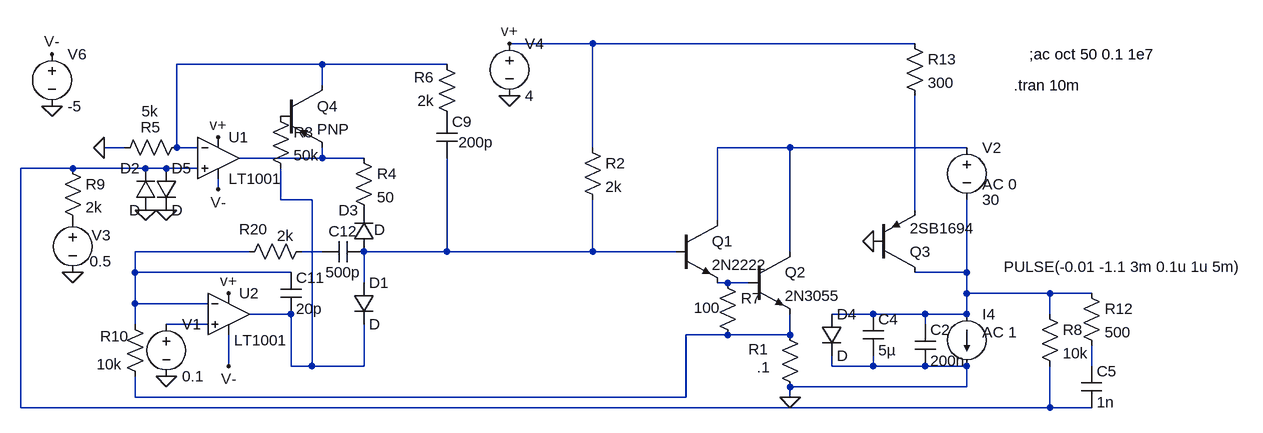
[diagram p0: schematic LDO Regler2 - simple_AW.asc]
LDO Regler2 - simple_AW.asc, the LTspice schematic file:
Version 4
SHEET 1 20904 1220
WIRE 5696 -5488 5568 -5488
WIRE 6192 -5488 5696 -5488
WIRE 5280 -5456 5056 -5456
WIRE 5472 -5456 5280 -5456
WIRE 5280 -5424 5280 -5456
WIRE 4976 -5328 4944 -5328
WIRE 5056 -5328 5056 -5456
WIRE 5088 -5328 5056 -5328
WIRE 5696 -5328 5696 -5488
WIRE 6000 -5328 5888 -5328
WIRE 6272 -5328 6000 -5328
WIRE 5280 -5312 5280 -5328
WIRE 5280 -5312 5152 -5312
WIRE 5344 -5312 5280 -5312
WIRE 4896 -5296 4816 -5296
WIRE 5008 -5296 4896 -5296
WIRE 5040 -5296 5008 -5296
WIRE 5088 -5296 5040 -5296
WIRE 5120 -5264 5120 -5280
WIRE 5216 -5248 5216 -5296
WIRE 5264 -5248 5216 -5248
WIRE 6192 -5232 6192 -5408
WIRE 5888 -5216 5888 -5328
WIRE 5168 -5168 4992 -5168
WIRE 5280 -5168 5248 -5168
WIRE 5472 -5168 5472 -5312
WIRE 5472 -5168 5344 -5168
WIRE 5696 -5168 5696 -5248
WIRE 5696 -5168 5472 -5168
WIRE 5824 -5168 5696 -5168
WIRE 6000 -5168 6000 -5328
WIRE 4992 -5136 4992 -5168
WIRE 5232 -5136 4992 -5136
WIRE 6272 -5136 6272 -5248
WIRE 6272 -5136 6192 -5136
WIRE 5344 -5120 5344 -5168
WIRE 5904 -5120 5888 -5120
WIRE 5936 -5120 5904 -5120
WIRE 6272 -5104 6272 -5136
WIRE 6400 -5104 6272 -5104
WIRE 6464 -5104 6400 -5104
WIRE 4992 -5088 4992 -5136
WIRE 5104 -5088 4992 -5088
WIRE 5232 -5072 5168 -5072
WIRE 6128 -5072 6064 -5072
WIRE 6208 -5072 6128 -5072
WIRE 6272 -5072 6272 -5104
WIRE 6272 -5072 6208 -5072
WIRE 6400 -5072 6400 -5104
WIRE 4992 -5056 4992 -5088
WIRE 5104 -5056 5040 -5056
WIRE 6208 -5056 6208 -5072
WIRE 5904 -5040 5840 -5040
WIRE 6000 -5040 6000 -5072
WIRE 6000 -5040 5904 -5040
WIRE 5136 -4992 5136 -5040
WIRE 5232 -4992 5232 -5072
WIRE 5264 -4992 5264 -5248
WIRE 5264 -4992 5232 -4992
WIRE 5344 -4992 5344 -5056
WIRE 5344 -4992 5264 -4992
WIRE 6064 -4992 6064 -5008
WIRE 6128 -4992 6128 -5008
WIRE 6128 -4992 6064 -4992
WIRE 6208 -4992 6128 -4992
WIRE 6272 -4992 6208 -4992
WIRE 6464 -4992 6464 -5024
WIRE 6272 -4960 6272 -4992
WIRE 6272 -4960 6000 -4960
WIRE 4992 -4944 4992 -4976
WIRE 5840 -4944 5840 -5040
WIRE 5840 -4944 4992 -4944
WIRE 6000 -4944 6000 -4960
WIRE 4816 -4928 4816 -5296
WIRE 6400 -4928 6400 -4992
WIRE 6400 -4928 4816 -4928
WIRE 6464 -4928 6400 -4928
FLAG 6000 -4944 0
FLAG 4896 -5136 0
FLAG 5040 -5232 0
FLAG 4864 -5392 0
FLAG 4864 -5472 V-
FLAG 5120 -5264 V-
FLAG 4944 -5328 0
FLAG 5136 -4992 V-
FLAG 5568 -5488 v+
FLAG 5136 -5104 v+
FLAG 5120 -5344 v+
FLAG 5008 -5232 0
FLAG 5040 -4976 0
FLAG 6128 -5184 0
FLAG 5568 -5408 0
SYMBOL voltage 6272 -5344 R0
WINDOW 123 24 72 Left 2
WINDOW 39 24 44 Left 2
SYMATTR Value2 AC 0
SYMATTR InstName V2
SYMATTR Value 30
SYMBOL npn 5936 -5168 R0
SYMATTR InstName Q2
SYMATTR Value 2N3055
SYMBOL res 5984 -5056 R0
WINDOW 0 -17 38 Right 2
WINDOW 3 -15 66 Right 2
SYMATTR InstName R1
SYMATTR Value .1
SYMBOL npn 5824 -5216 R0
SYMATTR InstName Q1
SYMATTR Value 2N2222
SYMBOL voltage 5040 -5072 R0
WINDOW 123 24 72 Left 2
WINDOW 39 24 44 Left 2
SYMATTR InstName V1
SYMATTR Value 0.1
SYMBOL diode 5360 -5168 R180
WINDOW 0 24 64 Left 2
WINDOW 3 -17 34 Left 2
SYMATTR InstName D3
SYMBOL cap 6192 -5056 R0
SYMATTR InstName C2
SYMATTR Value 200n
SYMATTR SpiceLine Rser=10m
SYMBOL res 6384 -5088 R0
SYMATTR InstName R8
SYMATTR Value 10k
SYMBOL res 4880 -5312 R0
SYMATTR InstName R9
SYMATTR Value 2k
SYMBOL voltage 4896 -5232 R0
WINDOW 123 24 72 Left 2
WINDOW 39 24 44 Left 2
WINDOW 0 29 39 Left 2
WINDOW 3 26 79 Left 2
SYMATTR InstName V3
SYMATTR Value 0.5
SYMBOL voltage 5568 -5504 R0
WINDOW 123 24 72 Left 2
WINDOW 39 24 44 Left 2
SYMATTR InstName V4
SYMATTR Value 4
SYMBOL current 6272 -5072 R0
WINDOW 3 57 -73 Left 2
WINDOW 123 24 28 Left 2
WINDOW 39 0 0 Left 2
SYMATTR Value PULSE(-0.01 -1.1 3m 0.1u 1u 5m)
SYMATTR Value2 AC 1
SYMATTR InstName I4
SYMBOL res 5888 -5136 R0
WINDOW 3 -36 54 Left 2
SYMATTR Value 100
SYMATTR InstName R7
SYMBOL cap 6112 -5072 R0
SYMATTR InstName C4
SYMATTR Value 5µ
SYMATTR SpiceLine Rser=0.2 Lser=50n
SYMBOL diode 5024 -5296 R0
SYMATTR InstName D5
SYMBOL res 6448 -5120 R0
SYMATTR InstName R12
SYMATTR Value 500
SYMBOL cap 6448 -4992 R0
SYMATTR InstName C5
SYMATTR Value 1n
SYMBOL res 5680 -5344 R0
SYMATTR InstName R2
SYMATTR Value 2k
SYMBOL voltage 4864 -5488 R0
WINDOW 123 24 72 Left 2
WINDOW 39 24 44 Left 2
SYMATTR InstName V6
SYMATTR Value -5
SYMBOL res 5328 -5328 R0
SYMATTR InstName R4
SYMATTR Value 50
SYMBOL res 5072 -5344 R90
WINDOW 0 0 56 VBottom 2
WINDOW 3 -56 57 VTop 2
SYMATTR InstName R5
SYMATTR Value 5k
SYMBOL res 5488 -5360 R180
WINDOW 0 36 76 Left 2
WINDOW 3 36 40 Left 2
SYMATTR InstName R6
SYMATTR Value 2k
SYMBOL cap 5456 -5376 R0
WINDOW 3 34 40 Left 2
SYMATTR Value 200p
SYMATTR InstName C9
SYMBOL Opamps\\LT1001 5136 -5136 R0
WINDOW 3 8 104 Left 2
SYMATTR InstName U2
SYMBOL diode 5328 -5120 R0
SYMATTR InstName D1
SYMBOL cap 5216 -5136 R0
SYMATTR InstName C11
SYMATTR Value 20p
SYMBOL res 4976 -5072 R0
WINDOW 0 -38 34 Left 2
WINDOW 3 -43 77 Left 2
SYMATTR InstName R10
SYMATTR Value 10k
SYMBOL cap 5344 -5184 R90
WINDOW 0 0 32 VBottom 2
WINDOW 3 32 32 VTop 2
SYMATTR InstName C12
SYMATTR Value 500p
SYMBOL res 5264 -5184 R90
WINDOW 0 -3 90 VBottom 2
WINDOW 3 -24 41 VTop 2
SYMATTR InstName R20
SYMATTR Value 2k
SYMBOL diode 5024 -5232 R180
WINDOW 0 24 64 Left 2
WINDOW 3 24 0 Left 2
SYMATTR InstName D2
SYMBOL pnp 6128 -5136 M180
SYMATTR InstName Q3
SYMATTR Value 2SB1694
SYMBOL res 6176 -5504 R0
SYMATTR InstName R13
SYMATTR Value 300
SYMBOL pnp 5216 -5424 R0
SYMATTR InstName Q4
SYMBOL res 5200 -5392 R0
SYMATTR InstName R3
SYMATTR Value 50k
SYMBOL Opamps\\LT1001 5120 -5376 R0
SYMATTR InstName U1
SYMBOL diode 6048 -5072 R0
SYMATTR InstName D4
TEXT 6344 -5424 Left 2 !.tran 10m
TEXT 6368 -5472 Left 2 !;ac oct 50 0.1 1e7

The netlist it stands for:
* LDO Regler2 - simple_AW.asc
V2 N002 N010 30 AC 0
Q2 N002 N011 N013 0 2N3055
R1 N013 0 .1
Q1 N002 N009 N011 0 2N2222
V1 N012 0 0.1
D3 N009 P001 D
C2 N010 0 200n Rser=10m
R8 N010 N004 10k
R9 N004 P002 2k
V3 P002 0 0.5
V4 v+ 0 4
I4 N010 0 PULSE(-0.01 -1.1 3m 0.1u 1u 5m) AC 1
R7 N011 N013 100
C4 N010 0 5µ Rser=0.2 Lser=50n
D5 N004 0 D
R12 N010 N014 500
C5 N014 N004 1n
R2 v+ N009 2k
V6 V- 0 -5
R4 N003 P001 50
R5 N001 0 5k
R6 P003 N001 2k
C9 P003 N009 200p
XU2 N012 N007 v+ V- N005 LT1001  ; pins In+ In- V+ V- OUT
D1 N009 N005 D
C11 N007 N005 20p
R10 N007 N013 10k
C12 N009 N008 500p
R20 N008 N007 2k
D2 0 N004 D
Q3 N010 0 N006 0 2SB1694
R13 v+ N006 300
Q4 N001 P004 N003 0 PNP
R3 P004 N005 50k
XU1 N004 N001 v+ V- N003 LT1001  ; pins In+ In- V+ V- OUT
D4 N010 0 D
.model D D
.lib standard.dio
.model NPN NPN
.model PNP PNP
.lib standard.bjt
.tran 10m
;ac oct 50 0.1 1e7
.lib LTC.lib
.backanno
.end